# Altium project TK032F8004_TK499.PrjPCB
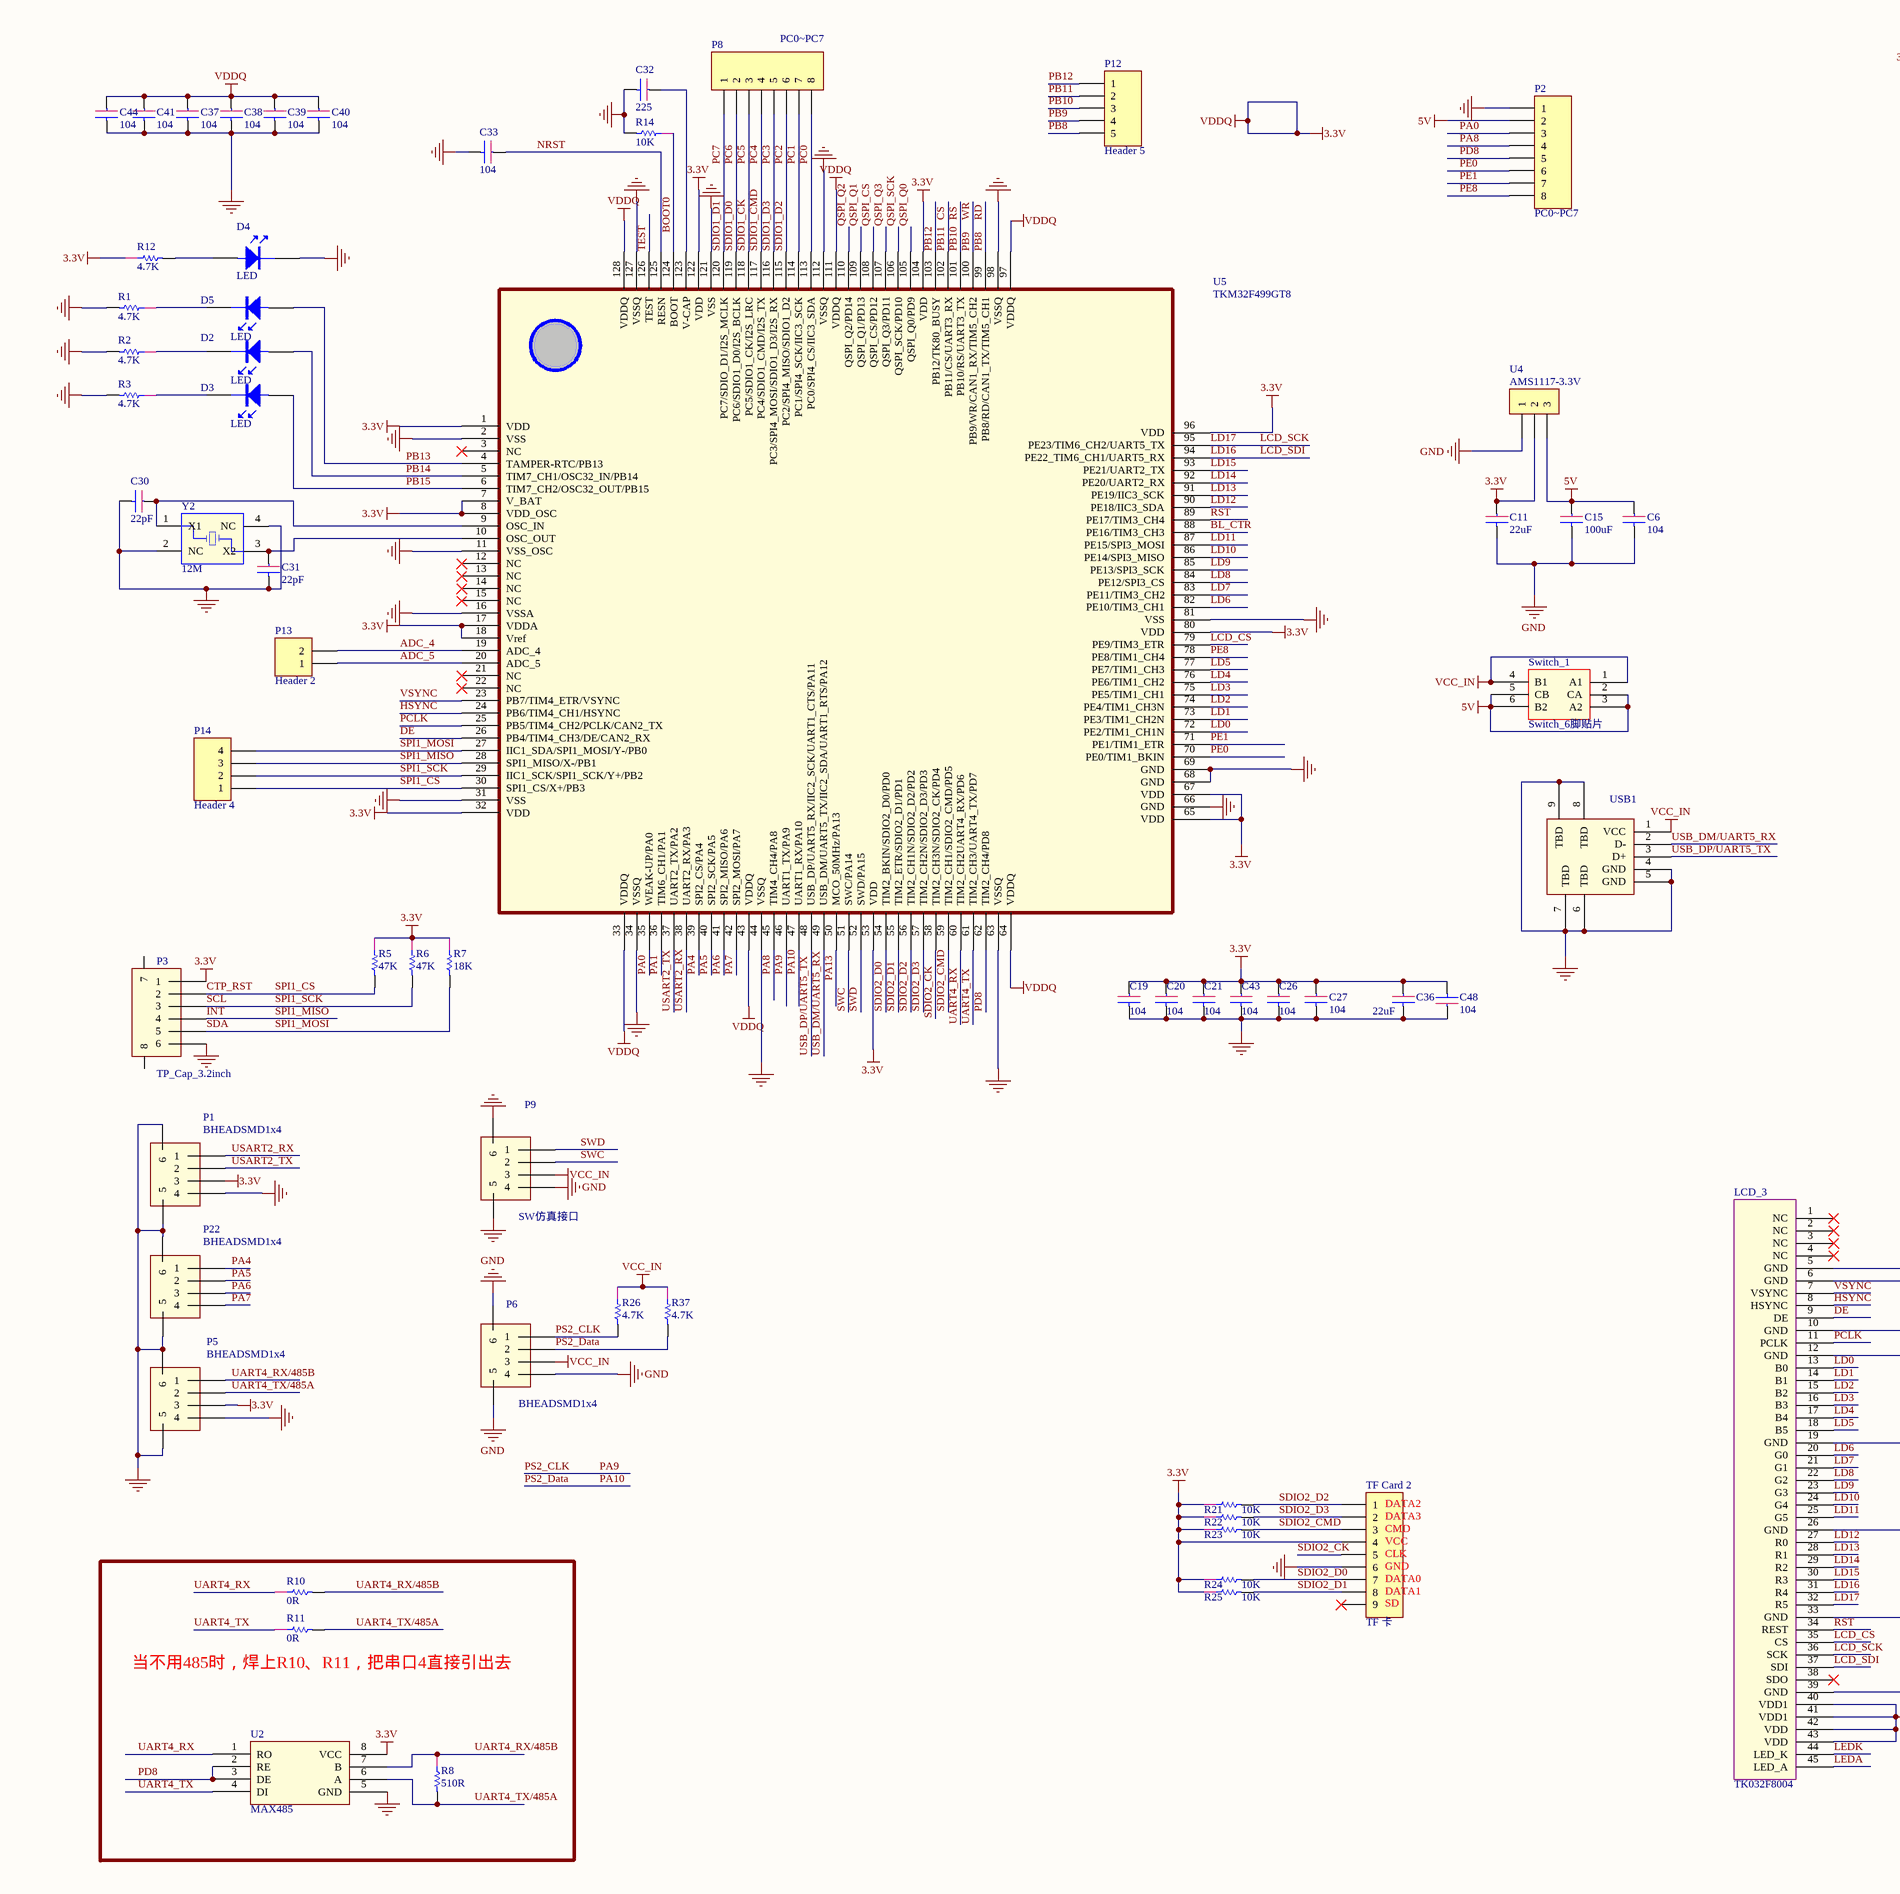
[diagram p0: TK032F8004_TK499.SchDoc, left]
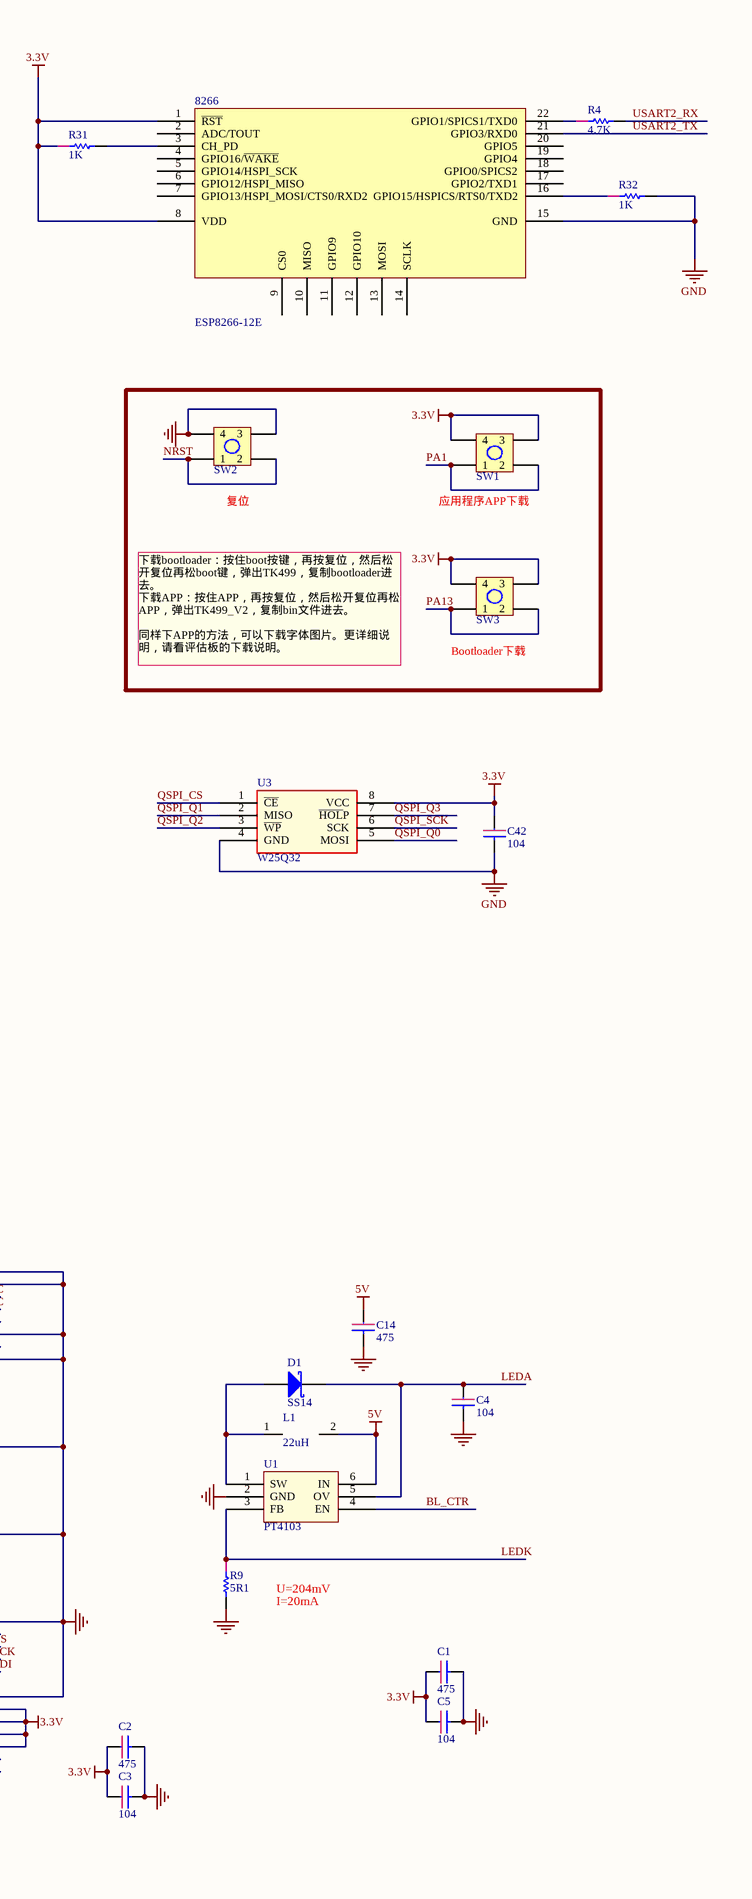
[diagram p1: TK032F8004_TK499.SchDoc, right]
1 sheet, 81 parts. Net scope: global (net labels, ports and power ports of the same name join across sheets).
Board files: TK032F8004_TK499.PcbDoc, TP_CAP.PcbDoc, TP_RTP.PcbDoc

## Sheet TK032F8004_TK499.SchDoc
size A2

### Parts
8266  ESP8266-12E  [ESP8266-12E]
C1  475  [C0603-2]
C2  475  [C0603-2]
C3  104  [C0603-1]
C4  104  [C0603-2]
C5  104  [C0603-1]
C6  104  [C0603-1]
C11  22uF  [C0805-3]
C14  475  [C0603-2]
C15  100uF  [Case B 3528]
C19  104  [C0603-1]
C20  104  [C0603-1]
C21  104  [C0603-1]
C26  104  [C0603-1]
C27  104  [C0603-2]
C30  22pF  [C0603-1]
C31  22pF  [C0603-1]
C32  225  [C0603-2]
C33  104  [C0603-1]
C36  22uF  [C0805-3]
C37  104  [C0603-1]
C38  104  [C0603-1]
C39  104  [C0603-1]
C40  104  [C0603-1]
C41  104  [C0603-1]
C42  104  [C0603-1]
C43  104  [C0603-1]
C44  104  [C0603-1]
C48  104  [C0603-1]
D1  SS14  [SOD123]
D2  LED  [D0603]
D3  LED  [D0603]
D4  LED  [D0603]
D5  LED  [D0603]
L1  22uH  [L1206]
LCD_3  TK032F8004  [TK032F8004]
P1  BHEADSMD1x4  [BHEADSMD1x4]
P2  PC0~PC7  [HDR1X8]
P3  TP_Cap_3.2inch  [TK032F8004_CTP]
P5  BHEADSMD1x4  [BHEADSMD1x4]
P6  BHEADSMD1x4  [BHEADSMD1x4]
P8  PC0~PC7  [HDR1X8]
P9  SW仿真接口  [BHEADSMD1x4]
P12  Header 5  [HDR1X5]
P13  Header 2  [HDR1X2]
P14  Header 4  [BHEADSMD1x4]
P22  BHEADSMD1x4  [BHEADSMD1x4]
R1  4.7K  [R0603]
R2  4.7K  [R0603]
R3  4.7K  [R0603]
R4  4.7K  [R0603]
R5  47K  [R0603]
R6  47K  [R0603]
R7  18K  [R0603]
R8  510R  [R0603]
R9  5R1  [R0603]
R10  0R  [R0603]
R11  0R  [R0603]
R12  4.7K  [R0603]
R14  10K  [R0603]
R21  10K  [R0603]
R22  10K  [R0603]
R23  10K  [R0603]
R24  10K  [R0603]
R25  10K  [R0603]
R26  4.7K  [R0603]
R31  1K  [R0603]
R32  1K  [R0603]
R37  4.7K  [R0603]
SW1  SW  [SW]  (value not drawn)
SW2  SW  [SW]  (value not drawn)
SW3  SW  [SW]  (value not drawn)
Switch_1  Switch_6脚贴片  [Switch_6脚贴片]
TF_Card_2  TF 卡  [Micro_SD]
U1  PT4103  [SOT23-6]
U2  MAX485  [SOP8-150]
U3  W25Q32  [SOP8-215-50]
U4  AMS1117-3.3V  [SOT-223]
U5  TKM32F499GT8  [LQFP128]
USB1  Micro USB  [MicroUSB_带定位柱]  (value not drawn)
Y2  12M  [X3225]

### Blocks framed on the sheet
当不用485时，焊上R10、R11，把串口4直接引出去: R8 R10 R11 U2

### Nets
3.3V: 8266.1(~{RST}) 8266.8(VDD) C1.1 C2.1 C3.1 C5.1 C11.1 C19.1 C20.1 C21.1 C26.1 C27.1 C36.1 C37.1 C38.1 C39.1 C40.1 C41.1 C42.1 C43.1 C44.1 C48.2 LCD_3.40(VDD1) LCD_3.41(VDD1) LCD_3.42(VDD) LCD_3.43(VDD) P1.3 P3.1 P5.3 R5.1 R6.1 R7.1 R12.1 R21.1 R22.1 R23.1 R24.1 R25.1 R31.1 SW1.3 SW1.4 SW3.3 SW3.4 TF_Card_2.4 U2.8(VCC) U3.8(VCC) U4.2 U5.1(VDD) U5.7(V_BAT) U5.8(VDD_OSC) U5.17(VDDA) U5.18(Vref) U5.32(VDD) U5.33(VDDQ) U5.43(VDDQ) U5.53(VDD) U5.64(VDDQ) U5.65(VDD) U5.67(VDD) U5.80(VDD) U5.96(VDD) U5.97(VDDQ) U5.104(VDD) U5.111(VDDQ) U5.122(VDD) U5.128(VDDQ)  [also labelled VDDQ]
5V: C6.1 C14.1 C15.1 L1.2 P2.2 Switch_1.2(CA) Switch_1.3(A2) Switch_1.5(CB) Switch_1.6(B2) U1.6(IN) U4.3
GND: 8266.15(GND) C1.2 C2.2 C3.2 C4.2 C5.2 C6.2 C11.2 C14.2 C15.2 C19.2 C20.2 C21.2 C26.2 C27.2 C30.2 C31.2 C32.2 C33.2 C36.2 C37.2 C38.2 C39.2 C40.2 C41.2 C42.2 C43.2 C44.2 C48.1 D4.2 LCD_3.5(GND) LCD_3.6(GND) LCD_3.10(GND) LCD_3.12(GND) LCD_3.19(GND) LCD_3.26(GND) LCD_3.33(GND) LCD_3.39(GND) P1.4 P1.5 P1.6 P2.1 P3.6 P5.4 P5.5 P5.6 P6.4 P6.5 P6.6 P9.4 P9.5 P9.6 P22.5 P22.6 R1.2 R2.2 R3.2 R9.2 R14.2 R32.2 SW2.3 SW2.4 TF_Card_2.6 U1.2(GND) U2.5(GND) U3.4(GND) U4.1 U5.2(VSS) U5.11(VSS_OSC) U5.16(VSSA) U5.31(VSS) U5.34(VSSQ) U5.44(VSSQ) U5.63(VSSQ) U5.66(GND) U5.68(GND) U5.69(GND) U5.81(VSS) U5.98(VSSQ) U5.112(VSSQ) U5.121(VSS) U5.127(VSSQ) USB1.4(GND) USB1.5(GND) USB1.6(TBD) USB1.7(TBD) USB1.8(TBD) USB1.9(TBD) Y2.2(NC) Y2.4(NC)
VCC_IN: P6.3 P9.3 R26.1 R37.1 Switch_1.1(A1) Switch_1.4(B1) USB1.1(VCC)
ADC_4: P13.2 U5.19(ADC_4)
ADC_5: P13.1 U5.20(ADC_5)
BL_CTR: U1.4(EN) U5.88(PE16/TIM3_CH3)
BOOT0: R14.1 U5.124(BOOT)
CS: P12.2 U5.102(PB11/CS/UART3_RX)  [also labelled PB11]
CTP_RST: P3.2 P14.1 R5.2 U5.30(SPI1_CS/X+/PB3)  [also labelled SPI1_CS]
DE: LCD_3.9(DE) U5.26(PB4/TIM4_CH3/DE/CAN2_RX)
HSYNC: LCD_3.8(HSYNC) U5.24(PB6/TIM4_CH1/HSYNC)
INT: P3.4 P14.3 U5.28(SPI1_MISO/X-/PB1)  [also labelled SPI1_MISO]
LCD_CS: LCD_3.35(CS) U5.79(PE9/TIM3_ETR)
LCD_SCK: LCD_3.32(R5) LCD_3.36(SCK) U5.95(PE23/TIM6_CH2/UART5_TX)  [also labelled LD17]
LCD_SDI: LCD_3.31(R4) LCD_3.37(SDI) U5.94(PE22_TIM6_CH1/UART5_RX)  [also labelled LD16]
LD0: LCD_3.13(B0) U5.72(PE2/TIM1_CH1N)
LD1: LCD_3.14(B1) U5.73(PE3/TIM1_CH2N)
LD2: LCD_3.15(B2) U5.74(PE4/TIM1_CH3N)
LD3: LCD_3.16(B3) U5.75(PE5/TIM1_CH1)
LD4: LCD_3.17(B4) U5.76(PE6/TIM1_CH2)
LD5: LCD_3.18(B5) U5.77(PE7/TIM1_CH3)
LD6: LCD_3.20(G0) U5.82(PE10/TIM3_CH1)
LD7: LCD_3.21(G1) U5.83(PE11/TIM3_CH2)
LD8: LCD_3.22(G2) U5.84(PE12/SPI3_CS)
LD9: LCD_3.23(G3) U5.85(PE13/SPI3_SCK)
LD10: LCD_3.24(G4) U5.86(PE14/SPI3_MISO)
LD11: LCD_3.25(G5) U5.87(PE15/SPI3_MOSI)
LD12: LCD_3.27(R0) U5.90(PE18/IIC3_SDA)
LD13: LCD_3.28(R1) U5.91(PE19/IIC3_SCK)
LD14: LCD_3.29(R2) U5.92(PE20/UART2_RX)
LD15: LCD_3.30(R3) U5.93(PE21/UART2_TX)
LEDA: C4.1 D1.2(K) LCD_3.45(LED_A) U1.5(OV)
LEDK: LCD_3.44(LED_K) R9.1 U1.3(FB)
NRST: C33.1 SW2.1 SW2.2 U5.125(RESN)
PA0: P2.3 U5.35(WEAK-UP/PA0)
PA1: SW1.1 SW1.2 U5.36(TIM6_CH1/PA1)
PA4: P22.1 U5.39(SPI2_CS/PA4)
PA5: P22.2 U5.40(SPI2_SCK/PA5)
PA6: P22.3 U5.41(SPI2_MISO/PA6)
PA7: P22.4 U5.42(SPI2_MOSI/PA7)
PA8: P2.4 U5.45(TIM4_CH4/PA8)
PA9: P6.1 R26.2 U5.46(UART1_TX/PA9)  [also labelled PS2_CLK]
PA10: P6.2 R37.2 U5.47(UART1_RX/PA10)  [also labelled PS2_Data]
PA13: SW3.1 SW3.2 U5.50(MCO_50MHz/PA13)
PB8: P12.5 U5.99(PB8/RD/CAN1_TX/TIM5_CH1)  [also labelled RD]
PB9: P12.4 U5.100(PB9/WR/CAN1_RX/TIM5_CH2)  [also labelled WR]
PB10: P12.3 U5.101(PB10/RS/UART3_TX)  [also labelled RS]
PB12: P12.1 U5.103(PB12/TK80_BUSY)
PB13: D5.1 U5.4(TAMPER-RTC/PB13)
PB14: D2.1 U5.5(TIM7_CH1/OSC32_IN/PB14)
PB15: D3.1 U5.6(TIM7_CH2/OSC32_OUT/PB15)
PC0: P8.8 U5.113(PC0/SPI4_CS/IIC3_SDA)
PC1: P8.7 U5.114(PC1/SPI4_SCK/IIC3_SCK)
PC2: P8.6 U5.115(PC2/SPI4_MISO/SDIO1_D2)  [also labelled SDIO1_D2]
PC3: P8.5 U5.116(PC3/SPI4_MOSI/SDIO1_D3/I2S_RX)  [also labelled SDIO1_D3]
PC4: P8.4 U5.117(PC4/SDIO1_CMD/I2S_TX)  [also labelled SDIO1_CMD]
PC5: P8.3 U5.118(PC5/SDIO1_CK/I2S_LRC)  [also labelled SDIO1_CK]
PC6: P8.2 U5.119(PC6/SDIO1_D0/I2S_BCLK)  [also labelled SDIO1_D0]
PC7: P8.1 U5.120(PC7/SDIO_D1/I2S_MCLK)  [also labelled SDIO1_D1]
PCLK: LCD_3.11(PCLK) U5.25(PB5/TIM4_CH2/PCLK/CAN2_TX)
PD8: P2.5 U2.2(RE) U2.3(DE) U5.62(TIM2_CH4/PD8)
PE0: P2.6 U5.70(PE0/TIM1_BKIN)
PE1: P2.7 U5.71(PE1/TIM1_ETR)
PE8: P2.8 U5.78(PE8/TIM1_CH4)
QSPI_CS: U3.1(~{CE}) U5.108(QSPI_CS/PD12)
QSPI_Q0: U3.5(MOSI) U5.105(QSPI_Q0/PD9)
QSPI_Q1: U3.2(MISO) U5.109(QSPI_Q1/PD13)
QSPI_Q2: U3.3(~{WP}) U5.110(QSPI_Q2/PD14)
QSPI_Q3: U3.7(~{HOL}P) U5.107(QSPI_Q3/PD11)
QSPI_SCK: U3.6(SCK) U5.106(QSPI_SCK/PD10)
RST: LCD_3.34(REST) U5.89(PE17/TIM3_CH4)
SCL: P3.3 P14.2 R6.2 U5.29(IIC1_SCK/SPI1_SCK/Y+/PB2)  [also labelled SPI1_SCK]
SDA: P3.5 P14.4 R7.2 U5.27(IIC1_SDA/SPI1_MOSI/Y-/PB0)  [also labelled SPI1_MOSI]
SDIO2_CK: TF_Card_2.5 U5.58(TIM2_CH3N/SDIO2_CK/PD4)
SDIO2_CMD: R23.2 TF_Card_2.3 U5.59(TIM2_CH1/SDIO2_CMD/PD5)
SDIO2_D0: R24.2 TF_Card_2.7 U5.54(TIM2_BKIN/SDIO2_D0/PD0)
SDIO2_D1: R25.2 TF_Card_2.8 U5.55(TIM2_ETR/SDIO2_D1/PD1)
SDIO2_D2: R21.2 TF_Card_2.1 U5.56(TIM2_CH1N/SDIO2_D2/PD2)
SDIO2_D3: R22.2 TF_Card_2.2 U5.57(TIM2_CH2N/SDIO2_D3/PD3)
SWC: P9.2 U5.51(SWC/PA14)
SWD: P9.1 U5.52(SWD/PA15)
TEST: U5.126(TEST)
UART4_RX: R10.1 U2.1(RO) U5.60(TIM2_CH2UART4_RX/PD6)
UART4_RX/485B: P5.1 R8.1 R10.2 U2.7(B)
UART4_TX: R11.1 U2.4(DI) U5.61(TIM2_CH3/UART4_TX/PD7)
UART4_TX/485A: P5.2 R8.2 R11.2 U2.6(A)
USART2_RX: P1.1 R4.2 U5.38(UART2_RX/PA3)
USART2_TX: 8266.21(GPIO3/RXD0) P1.2 U5.37(UART2_TX/PA2)
USB_DM/UART5_RX: U5.49(USB_DM/UART5_TX/IIC2_SDA/UART1_RTS/PA12) USB1.2(D-)
USB_DP/UART5_TX: U5.48(USB_DP/UART5_RX/IIC2_SCK/UART1_CTS/PA11) USB1.3(D+)
VSYNC: LCD_3.7(VSYNC) U5.23(PB7/TIM4_ETR/VSYNC)
Net8266_3: 8266.3(CH_PD) R31.2
Net8266_16: 8266.16(GPIO15/HSPICS/RTS0/TXD2) R32.1
Net8266_22: 8266.22(GPIO1/SPICS1/TXD0) R4.1
NetC30_1: C30.1 U5.9(OSC_IN) Y2.1(X1)
NetC31_1: C31.1 U5.10(OSC_OUT) Y2.3(X2)
NetC32_1: C32.1 U5.123(V-CAP)
NetD1_1: D1.1(A) L1.1 U1.1(SW)
NetD2_2: D2.2 R2.1
NetD3_2: D3.2 R3.1
NetD4_1: D4.1 R12.2
NetD5_2: D5.2 R1.1

Not connected (* = marked no-connect by the designer): 8266 2(ADC/TOUT) 4(GPIO16/~{WAKE}) 5(GPIO14/HSPI_SCK) 6(GPIO12/HSPI_MISO) 7(GPIO13/HSPI_MOSI/CTS0/RXD2) 9(CS0) 10(MISO) 11(GPIO9) 12(GPIO10) 13(MOSI) 14(SCLK) 17(GPIO2/TXD1) 18(GPIO0/SPICS2) 19(GPIO4) 20(GPIO5); LCD_3 1(NC)* 2(NC)* 3(NC)* 4(NC)* 38(SDO)*; P3 7 8; TF_Card_2 9*; U5 3(NC)* 12(NC)* 13(NC)* 14(NC)* 15(NC)* 21(NC)* 22(NC)*

### Notes on the sheet
- (near SW2) 复位
- (near SW1) 应用程序APP下载
- 下载bootloader：按住boot按键，再按复位，然后松开复位再松boot键，弹出TK499，复制bootloader进去。
  下载APP：按住APP，再按复位，然后松开复位再松APP，弹出TK499_V2，复制bin文件进去。
  同样下APP的方法，可以下载字体图片。更详细说明，请看评估板的下载说明。
- (near SW3) Bootloader下载
- (near TF_Card_2) DATA2
- (near TF_Card_2) DATA0
- (near TF_Card_2) DATA3
- (near TF_Card_2) GND
- (near TF_Card_2) VCC
- (near TF_Card_2) CMD
- (near TF_Card_2) CLK
- (near TF_Card_2) DATA1
- (near TF_Card_2) SD
- U=204mV
- I=20mA

### Library data of the parts
C1-C6 C11 C14 C15 C19-C21 C26 C27 C30-C33 C36-C44 C48 = cap
D1 = D Schottky: Schottky Diode; Published: 8-Jun-2000; LatestRevisionDate: 17-Jul-2002; LatestRevisionNote: Re-released for DXP Platform.; PackageReference: SMB; Publisher: Altium Limited; PackageDescription: DO-214-AA/SMB; 2 C-Bend Leads; Body 5.3 x 3.6 mm, inc. leads (LxW); Code_JEDEC: DO-214-AA
L1 = Inductor
P2 P8 = Header 8: Header, 8-Pin; LatestRevisionDate: 17-Jul-2002; LatestRevisionNote: Re-released for DXP Platform.; Publisher: Altium Limited
P3 = BHEADSMD1x6
P9 = BHEADSMD1x4
P12 = Header 5: Header, 5-Pin; LatestRevisionDate: 17-Jul-2002; LatestRevisionNote: Re-released for DXP Platform.; Publisher: Altium Limited
P13 = Header 2: Header, 2-Pin; LatestRevisionDate: 17-Jul-2002; LatestRevisionNote: Re-released for DXP Platform.; Publisher: Altium Limited
P14 = Header 4: Header, 4-Pin; LatestRevisionDate: 17-Jul-2002; LatestRevisionNote: Re-released for DXP Platform.; Publisher: Altium Limited
R1-R12 R14 R21-R26 R31 R32 R37 = Resistor
TF_Card_2 = Header 9: Header, 9-Pin; LatestRevisionDate: 17-Jul-2002; LatestRevisionNote: Re-released for DXP Platform.; Publisher: Altium Limited
U1 = PT4101
U3 = W25Q16
U4 = CON3: Connector
USB1 = Mini USB
Y2 = 晶振_无源_4PIN_SMD